# Altium schematic sheet mach_koLED.SchDoc
size A2
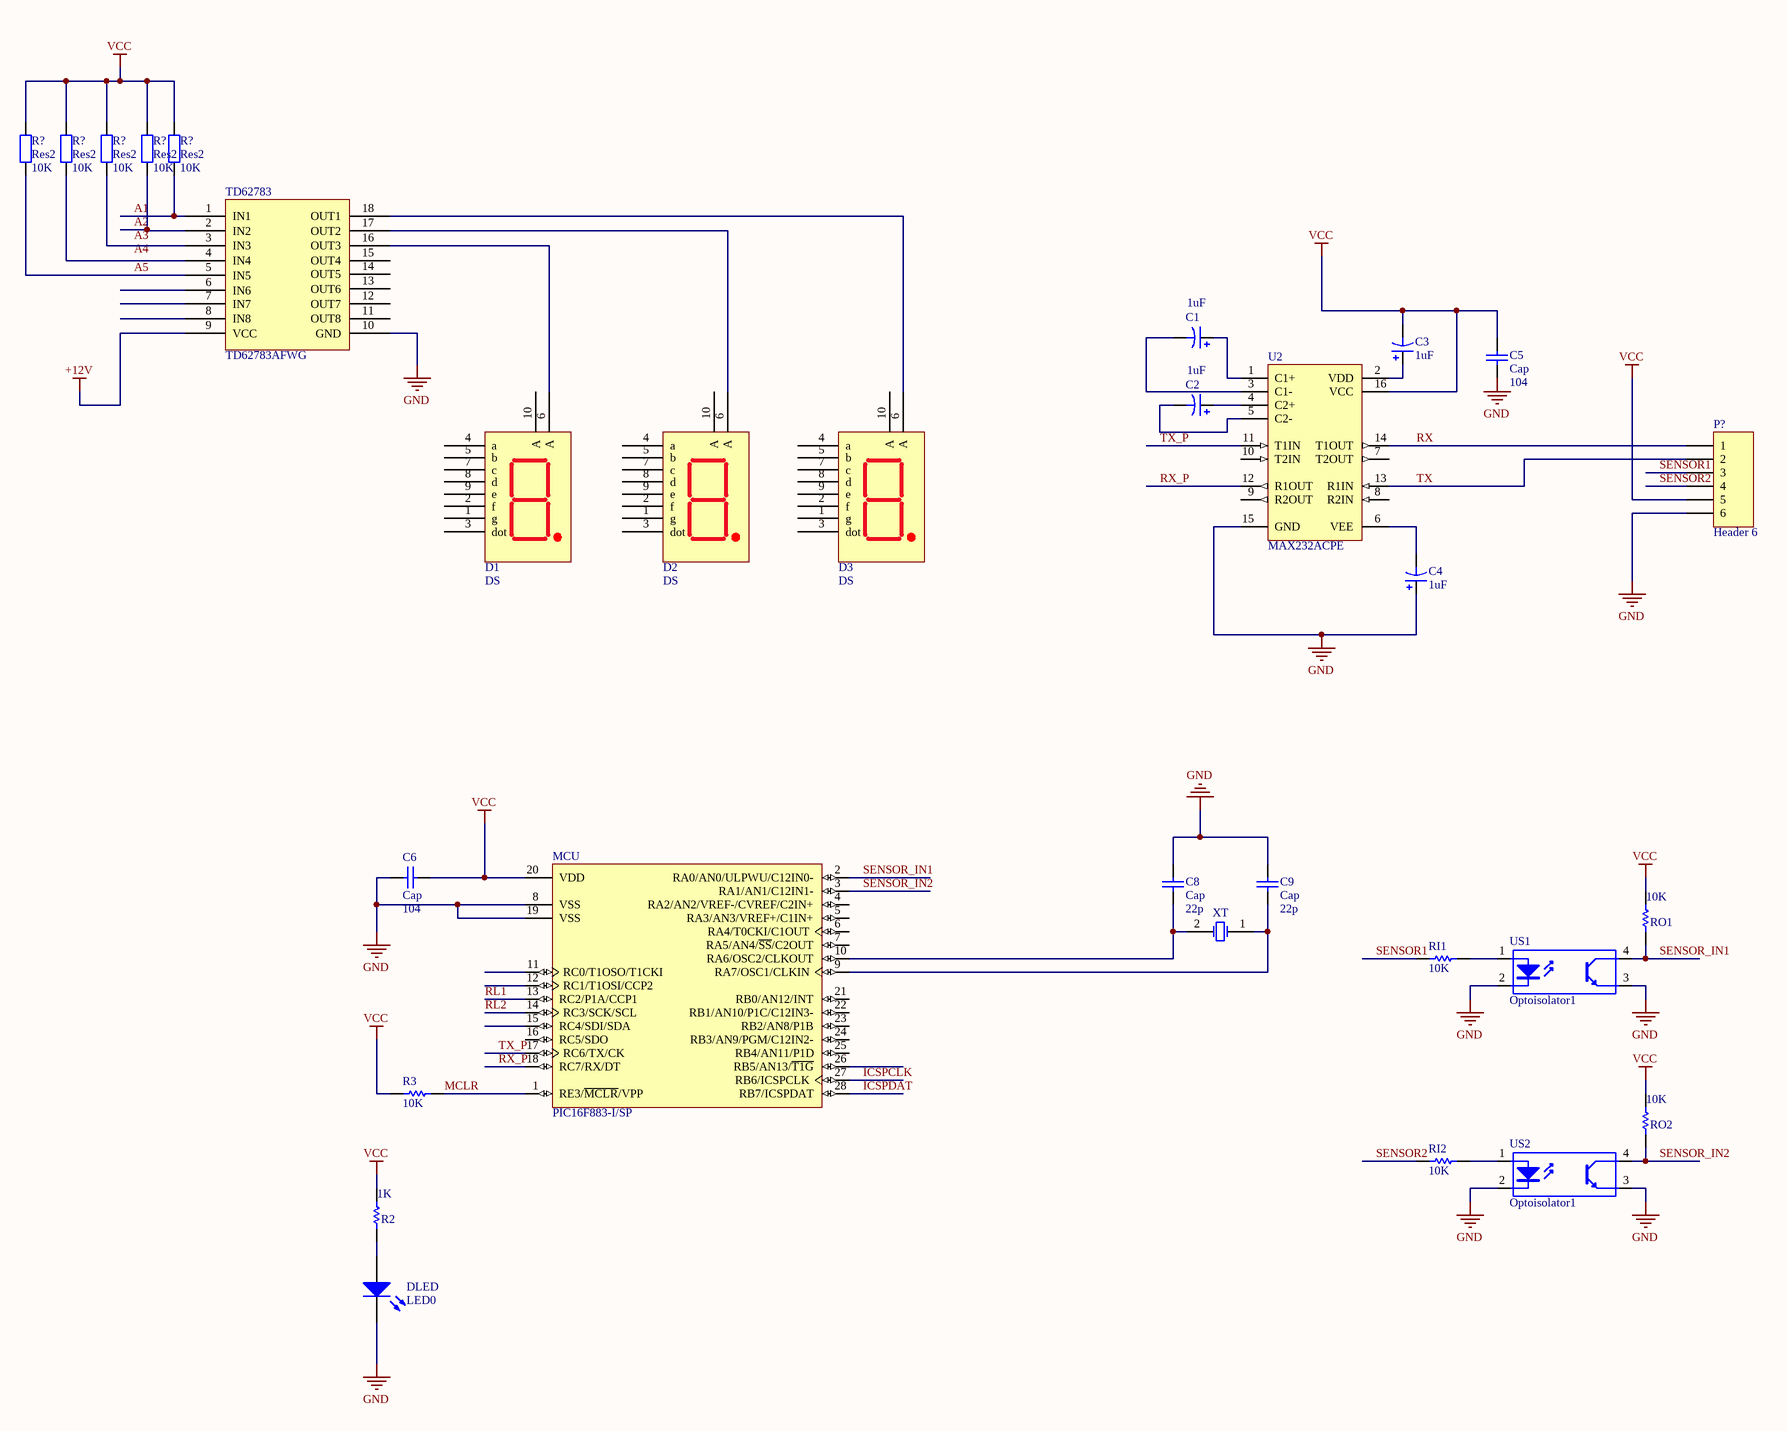
[diagram p0: mach_koLED.SchDoc]

## Parts
(Parts that share a designator on the sheet are numbered #1, #2 ... from top to bottom, then left to right.)
C1  value 1uF  [tu 10uF]  (hidden comment: Cap Pol1)
C2  value 1uF  [tu 10uF]  (hidden comment: Cap Pol1)
C3  value 1uF  [tu 10uF]  (hidden comment: Cap Pol1)
C4  value 1uF  [tu 10uF]  (hidden comment: Cap Pol1)
C5  Cap  value 104  [tu_gom]
C6  Cap  value 104  [tu_gom]
C8  Cap  value 22p  [tu_gom]
C9  Cap  value 22p  [tu_gom]
D1  DS  [7SEG_1DIGIT_305x44]
D2  DS  [7SEG_1DIGIT_305x44]
D3  DS  [7SEG_1DIGIT_305x44]
DLED  LED0  [LED_3]
MCU  PIC16F883-I/SP  [SPDIP300-SP28]
P?  Header 6  [HDR1X6]
R2  1K  [R_Nor]
R3  10K  [R_Nor]
R?#1  Res2  value 10K  [AXIAL-0.4]
R?#2  Res2  value 10K  [AXIAL-0.4]
R?#3  Res2  value 10K  [AXIAL-0.4]
R?#4  Res2  value 10K  [AXIAL-0.4]
R?#5  Res2  value 10K  [AXIAL-0.4]
RI1  10K  [R_Nor]
RI2  10K  [R_Nor]
RO1  10K  [R_Nor]
RO2  10K  [R_Nor]
TD62783  TD62783AFWG
U2  MAX232ACPE  [PE16A]
US1  Optoisolator1  [Opto]
US2  Optoisolator1  [Opto]
XT  XTAL  [Xtal12M]  (value not drawn)

## Nets
+12V: TD62783.9(VCC)
GND: C4.1 C5.1 C6.2 C8.2 C9.2 DLED.2(K) MCU.8(VSS) MCU.19(VSS) P?.6 TD62783.10(GND) U2.15(GND) US1.2(K) US1.3(E) US2.2(K) US2.3(E)
VCC: C3.2 C5.2 C6.1 MCU.20(VDD) P?.5 R2.2 R3.2 R?#1.2 R?#2.2 R?#3.2 R?#4.2 R?#5.2 RO1.2 RO2.2 U2.16(VCC)
A1: R?#5.1 TD62783.1(IN1)
A2: R?#4.1 TD62783.2(IN2)
A5: R?#1.1 TD62783.5(IN5)
ICSPCLK: MCU.27(RB6/ICSPCLK)
ICSPDAT: MCU.28(RB7/ICSPDAT)
MCLR: MCU.1(RE3/~{MCLR}/VPP) R3.1
RL1: MCU.13(RC2/P1A/CCP1)
RL2: MCU.14(RC3/SCK/SCL)
RX: P?.1 U2.14(T1OUT)
RX_P: MCU.18(RC7/RX/DT) U2.12(R1OUT)
SENSOR1: P?.3 RI1.2
SENSOR2: P?.4 RI2.2
SENSOR_IN1: MCU.2(RA0/AN0/ULPWU/C12IN0-) RO1.1 US1.4(C)
SENSOR_IN2: MCU.3(RA1/AN1/C12IN1-) RO2.1 US2.4(C)
TX: P?.2 U2.13(R1IN)
TX_P: MCU.17(RC6/TX/CK) U2.11(T1IN)
NetC1_1: C1.1 U2.1(C1+)
NetC1_2: C1.2 U2.3(C1-)
NetC2_1: C2.1 U2.4(C2+)
NetC2_2: C2.2 U2.5(C2-)
NetC3_1: C3.1 U2.2(VDD)
NetC4_2: C4.2 U2.6(VEE)
NetC8_1: C8.1 MCU.10(RA6/OSC2/CLKOUT) XT.2(OSC2)
NetC9_1: C9.1 MCU.9(RA7/OSC1/CLKIN) XT.1(OSC1)
NetD1_6: D1.6(A) TD62783.16(OUT3)
NetD2_6: D2.6(A) TD62783.17(OUT2)
NetD3_6: D3.6(A) TD62783.18(OUT1)
NetDLED_1: DLED.1(A) R2.1
NetR?#2_1: R?#2.1 TD62783.4(IN4)
NetR?#3_1: R?#3.1 TD62783.3(IN3)
NetRI1_1: RI1.1 US1.1(A)
NetRI2_1: RI2.1 US2.1(A)

Not connected (* = marked no-connect by the designer): D1 1(g) 2(f) 3(dot) 4(a) 5(b) 7(c) 8(d) 9(e) 10(A); D2 1(g) 2(f) 3(dot) 4(a) 5(b) 7(c) 8(d) 9(e) 10(A); D3 1(g) 2(f) 3(dot) 4(a) 5(b) 7(c) 8(d) 9(e) 10(A); MCU 4(RA2/AN2/VREF-/CVREF/C2IN+) 5(RA3/AN3/VREF+/C1IN+) 6(RA4/T0CKI/C1OUT) 7(RA5/AN4/~{SS}/C2OUT) 11(RC0/T1OSO/T1CKI) 12(RC1/T1OSI/CCP2) 15(RC4/SDI/SDA) 16(RC5/SDO) 21(RB0/AN12/INT) 22(RB1/AN10/P1C/C12IN3-) 23(RB2/AN8/P1B) 24(RB3/AN9/PGM/C12IN2-) 25(RB4/AN11/P1D) 26(RB5/AN13/~{T1G}); TD62783 6(IN6) 7(IN7) 8(IN8) 11(OUT8) 12(OUT7) 13(OUT6) 14(OUT5) 15(OUT4); U2 7(T2OUT) 8(R2IN) 9(R2OUT) 10(T2IN)

## Notes on the sheet
- Labels drawn without touching a wire or pin: A3, A4

## Library data of the parts
C1-C4 = Cap Pol1: Polarized Capacitor (Radial); Published: 8-Jun-2000; LatestRevisionDate: 17-Jul-2002; LatestRevisionNote: Re-released for DXP Platform.; PackageReference: RB7.6-15; Publisher: Altium Limited
C5 C6 C8 C9 = Ceramic: Capcitor
D1-D3 = LED_1DIGIT_305x44
DLED = LED0: Typical INFRARED GaAs LED; Published: 8-Jun-2000; LatestRevisionDate: 08-Jul-2005; LatestRevisionNote: Mech Layer 1 removed.; PackageReference: LED-0; Publisher: Altium Limited
MCU = PIC16F883-I/SP: Flash-Based, 8-Bit CMOS Microcontroller with nanoWatt Technology, 4K (x14-Bit words) Program Memory, 512 Bytes Data Memory, 24 I/O pins, 28-Pin SPDIP, Standard VDD Range, Industrial Temperature; FirstPublished: 29-Jan-2009; LatestRevisionDate: 02-Dec-2009; LatestRevisionNote: Updated datasheet to version revF, Apr-2009.; DatasheetVersion: revF, Apr-2009; PackageVersion: revBB, Aug-2009; PackageReference: SPDIP300-SP28; Publisher: Altium Limited; PackageDescription: 28-Lead Skinny Plastic Dual In-Line (SP) - 300 mil Body [SPDIP]; Supplier 1: Digi-Key; Supplier Part Number 1: PIC16F883-I/SP-ND; Supplier 2: Farnell; Supplier Part Number 2: 1439533; Supplier 3: Newark; Supplier Part Number 3: 74K8558; ComponentLink1Description: Datasheet; ComponentLink1URL: http://ww1.microchip.com/downloads/en/DeviceDoc/41291F.pdf; ComponentLink2Description: Packaging Specification; ComponentLink2URL: http://www.microchip.com/stellent/groups/techpub_sg/documents/packagingspec/en012702.pdf; ComponentLink3Description: Microchip.com Home; ComponentLink3URL: http://www.microchip.com/
P? = Header 6: Header, 6-Pin; LatestRevisionDate: 17-Jul-2002; LatestRevisionNote: Re-released for DXP Platform.; Publisher: Altium Limited
R2 R3 RI1 RI2 RO1 RO2 = Res
R?#1-R?#5 = Res2: Resistor; Published: 8-Jun-2000; LatestRevisionDate: 17-Jul-2002; LatestRevisionNote: Re-released for DXP Platform.; PackageReference: AXIAL-0.4; Publisher: Altium Limited
TD62783 = TD62783AG
U2 = MAX232ACPE: +5V Powered, Multi-Channel RS-232 Driver/Receiver; Published: 16-Jan-2001; LatestRevisionDate: 29-May-2009; LatestRevisionNote: Component Body Added.; PackageVersion: 1997; PackageReference: PE16A; Publisher: Altium Limited; PackageDescription: DIP, 16-Pin, Row Spacing 7.62 mm, Pitch 2.54 mm; Code_JEDEC: MS-001-BB; ComponentLink1Description: Manufacturer Link; ComponentLink1URL: http://www.maxim-ic.com/; ComponentLink2Description: Datasheet; ComponentLink2URL: http://pdfserv.maxim-ic.com/en/ds/MAX220-MAX249.pdf
US1 US2 = Optoisolator1: 4-Pin Phototransistor Optocoupler; Published: 24-Mar-1999; LatestRevisionDate: 04-Mar-2005; LatestRevisionNote: Sch pins 3 & 4 Swapped.; DatasheetVersion: Nov-2003; PackageReference: DIP-4; Publisher: Altium Limited
XT = XTAL: Crystal Oscillator; Published: 8-Jun-2000; LatestRevisionDate: 17-Jul-2002; LatestRevisionNote: Re-released for DXP Platform.; PackageReference: R38; Publisher: Altium Limited